# EAGLE schematic Lab5 (EAGLE 7.0.0)
Lab 5 Jonathan Valvano
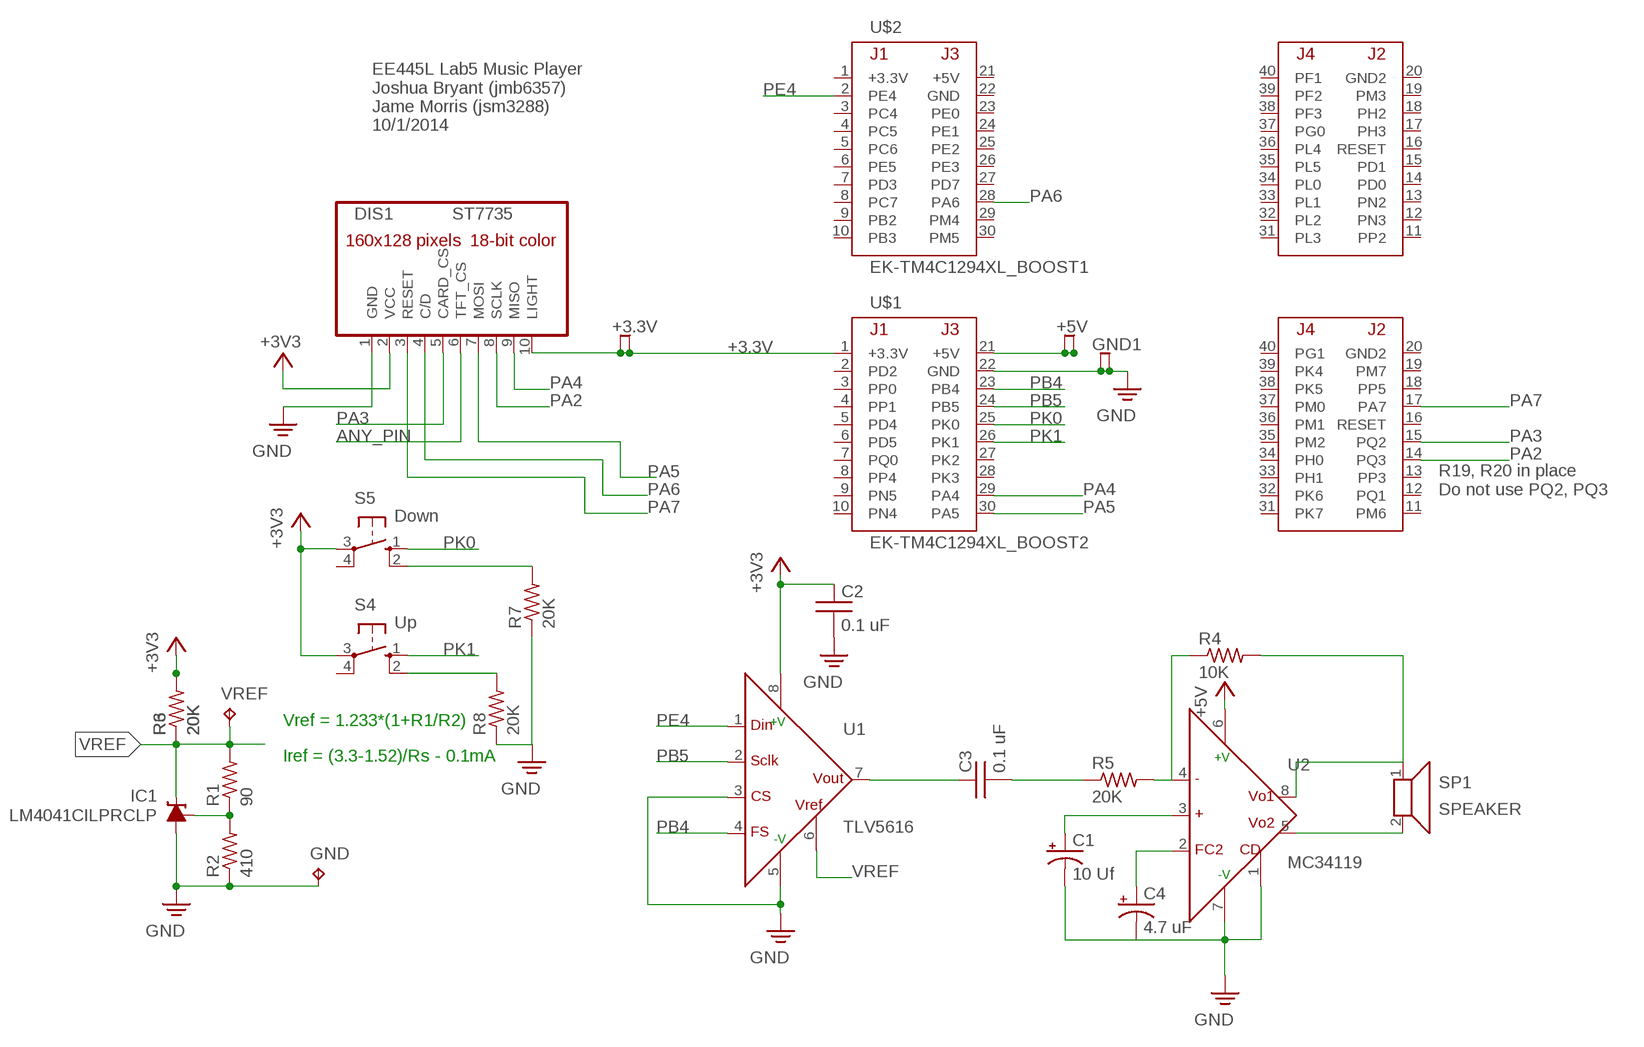
[diagram p0: schematic, sheet 1]

## Parts
+3.3V  TP2  [TP2]
+5V  TP2  [TP2]
C1  10 Uf  CAPACITOR_POLARIZEDE5-6  [CAP200MILPOLARIZED]
C2  0.1 uF  CAPACITOR050-024X044  [CAP200MIL]
C3  0.1 uF  CAPACITOR050-024X044  [CAP200MIL]
C4  4.7 uF  CAPACITOR_POLARIZEDE5-6  [CAP200MILPOLARIZED]
DIS1  ST7735  [ST7735]
GND  TP_KEYSTONE500X  [P1.1MM]
GND1  TP2  [TP2]
IC1  LM4041CILPRCLP  [LP_O-PBCY-W3]
R1  90  RESISTOR0204/7  [RES300MIL]
R2  410  RESISTOR0204/7  [RES300MIL]
R3  20K  RESISTOR0204/7  [RES300MIL]
R4  10K  RESISTOR0204/7  [RES300MIL]
R5  20K  RESISTOR0204/7  [RES300MIL]
R6  20K  RESISTOR0204/7  [RES300MIL]
R7  20K  RESISTOR0204/7  [RES300MIL]
R8  20K  RESISTOR0204/7  [RES300MIL]
S4  Up  B3F-1052  [B3F-10XX]
S5  Down  B3F-1052  [B3F-10XX]
SP1  SPEAKER  [1X02]
U1  TLV5616  [DIL08]
U2  MC34119  [DIL08]
U$1  EK-TM4C1294XL_BOOST2  [TM4C123LAUNCHPAD]
U$2  EK-TM4C1294XL_BOOST1  [TM4C123LAUNCHPAD]
VREF  TP_KEYSTONE500X  [P1.1MM]

## Nets
+3.3V: +3.3V.MP1(TPB) +3.3V.MP(TPA) DIS1.2(VCC) DIS1.10(LIGHT) U$1.1(+3.3V) ; supply symbol labelled +3V3
+3V3: C2.1 R3.2 R6.2 S4.3(P) S5.3(P) U1.8(VDD)
+5V: U2.6(VCC)
+5V1: +5V.MP1(TPB) +5V.MP(TPA) U$1.21(+5V)
ANY_PIN: DIS1.6(TFT_CS)
FB: IC1.1(FB) R1.1 R2.2
GND: C1.- C2.2 C4.- DIS1.1(GND) GND1.MP1(TPB) GND1.MP(TPA) GND.TP IC1.3(A) R2.1 R7.1 R8.1 U1.5(AGND) U2.1(CD) U2.7(GND) U$1.22(GND)
N$1: SP1.2
N$2: R4.2 SP1.1 U2.8(VO1)
N$3: C3.2 R5.1
N$4: U1.3(CS)
N$5: C3.1 U1.7(OUT)
N$6: R4.1 R5.2 U2.4(VIN)
N$7: C1.+ U2.3(FC1)
N$8: C4.+ U2.2(FC2)
N$9: R7.2 S5.2(S1)
N$10: R8.2 S4.2(S1)
PA2: DIS1.8(SCLK) U$1.14(PQ3)
PA3: DIS1.5(CARD_CS) U$1.15(PQ2)
PA4: DIS1.9(MISO) U$1.29(PA4)
PA5: DIS1.7(MOSI) U$1.30(PA5)
PA6: DIS1.4(C/D) U$2.28(PA6)
PA7: DIS1.3(RESET) U$1.17(PA7)
PB4: U1.4(FS) U$1.23(PB4)
PB5: U1.2(SCLK) U$1.24(PB5)
PE4: U1.1(DIN)
PK0: S5.1(S) U$1.25(PK0)
PK1: S4.1(S) U$1.26(PK1)
VREF: IC1.2(C) R1.2 R3.1 R6.1 U1.6(REFIN) VREF.TP
Unconnected: S4.4(P1) S5.4(P1) U2.5(VO2) U$1.2(PD2) U$1.3(PP0) U$1.4(PP1) U$1.5(PD4) U$1.6(PD5) U$1.7(PQ0) U$1.8(PP4) U$1.9(PN5) U$1.10(PN4) U$1.11(PM6) U$1.12(PQ1) U$1.13(PP3) U$1.16(RESET) U$1.18(PP5) U$1.19(PM7) U$1.27(PK2) U$1.28(PK3) U$1.31(PK7) U$1.32(PK6) U$1.33(PH1) U$1.34(PH0) U$1.35(PM2) U$1.36(PM1) U$1.37(PM0) U$1.38(PK5) U$1.39(PK4) U$1.40(PG1) U$2.2(PE4) U$2.3(PC4) U$2.4(PC5) U$2.5(PC6) U$2.6(PE5) U$2.7(PD3) U$2.8(PC7) U$2.9(PB2) U$2.10(PB3) U$2.11(PP2) U$2.12(PN3) U$2.13(PN2) U$2.14(PD0) U$2.15(PD1) U$2.16(RESET) U$2.17(PH3) U$2.18(PH2) U$2.19(PM3) U$2.23(PE0) U$2.24(PE1) U$2.25(PE2) U$2.26(PE3) U$2.27(PD7) U$2.29(PM4) U$2.30(PM5) U$2.31(PL3) U$2.32(PL2) U$2.33(PL1) U$2.34(PL0) U$2.35(PL5) U$2.36(PL4) U$2.37(PG0) U$2.38(PF3) U$2.39(PF2) U$2.40(PF1)

## Notes on the sheet
- EE445L Lab5 Music Player
  Joshua Bryant (jmb6357)
  Jame Morris (jsm3288)
  10/1/2014
- R19, R20 in place
  Do not use PQ2, PQ3
- Vref = 1.233*(1+R1/R2)
- Iref = (3.3-1.52)/Rs - 0.1mA

## Power pins joined to a net without a drawn wire
+3.3V: U$2.1(+3.3V)
+5V: U$2.21(+5V)
GND: U$2.22(GND)
GND2: U$1.20(GND2) U$2.20(GND2)

## Library data of the parts
+3.3V +5V GND1 = EE445L:TP2: Low-cost test point Made with two 0.8mm holes.
C1 C4 = EE445L:CAPACITOR_POLARIZED: POLARIZED CAPACITOR, American symbol
C2 C3 = EE445L:CAPACITOR: CAPACITOR, American symbol
DIS1 = EE445L:ST7735: Sitronix ST7735R 18-bit color, 1.8" TFT LCD display, 128*160, http://www.adafruit.com/products/358 // Backlight (pin 10) connected to +3.3 V // MISO (pin 9) PA4 (SSI0Rx) // SCK (pin 8) connected to PA2 (SSI0Clk) // MOSI (pin 7) connected to PA5 (SSI0Tx) // TFT_CS (pin 6) connected to PA3 (SSI0Fss) // CARD_CS (pin 5) connected to PD7 GPIO output(for SDC) // Data/Command (pin 4) connected to PA6 (GPIO), high for data, low for command // RESET (pin 3) connected to PA7 (GPIO) // VCC (pin 2) connected to +3.3 V // Gnd (pin 1) connected to ground; OC_FARNELL: unknown; OC_NEWARK: unknown
GND VREF = EE445L:TP: Test pad Test point, black, Keystone Electronics 5001, Digikey 5001K-ND Test point, orange, Keystone Electronics 5003, Digikey 5003K-ND Test point, yellow, Keystone Electronics 5004, Digikey 5004K-ND Test point, white, Keystone Electronics 5002, Digikey 5002K-ND Test point, red, Keystone Electronics 5000, Digikey 5000K-ND
IC1 = EE445L:LM4041CILPR: PRECISION MICROPOWER SHUNT VOLTAGE REFERENCE Adjustable Output Source: http://focus.ti.com/lit/ds/slcs146e/slcs146e.pdf LM4041CILPR Let R1 be the resistor from Vref to +3.3V Let R2 be the resistor from Vref to FB Let R3 be the resistor from FB to ground Vref = 1.23*(1+R3/R2) Iref=(3.3V-Vref)/R1 - 100uA; MPN: LM4041CILP; OC_FARNELL: 1673945; OC_NEWARK: 50M8856
R1-R8 = EE445L:RESISTOR: RESISTOR, American symbol
S4 S5 = EE445L:B3F-1052: OMRON SWITCH 1.1mm holes; MPN: B3F-1000; OC_FARNELL: 176432; OC_NEWARK: 36M3542
SP1 = EE445L:SPEAKER: Speaker Connected off PCB with two wires. 32-ohm speaker, AllElectronics, SK-230, http://www.allelectronics.com/make-a-store/item/sk-230/20-mm-32-ohm-speaker/1.html
U1 = EE445L:TLV5616: TLV5616 12-bit DAC SSI digital input, one analog output Vout = (2*n*Vref)/4096
U2 = EE445L:MC34119: MC34119 Audio amp http://users.ece.utexas.edu/~valvano/Datasheets/MC34119.pdf The MC34119 is a low power audio amplifier intergrated circuit intended (primarily) for telephone applications, such as in speakerphones. It provides differential speaker outputs to maximize output swing at low supply voltages (2.0 V minimum). Coupling capacitors to the speaker are not required. Open loop gain is 80 dB, and the closed loop gain is set with two external resistors. A Chip Disable pin permits powering down and/or muting the input signal. The MC34119 is available in standard 8–pin DIP, SOIC package, and TSSOP package. • Wide Operating Supply Voltage Range (2.0 V to 16 V), Allows Telephone Line Powered Applications • Low Quiescent Supply Current (2.7 mA Typ) for Battery Powered Applications • Chip Disable Input to Power Down the IC • Low Power–Down Quiescent Current (65 mA Typ) • Drives a Wide Range of Speaker Loads (8.0 W and Up) • Output Power Exceeds 250 mW with 32 W Speaker • Low Total Harmonic Distortion (0.5% Typ) • Gain Adjustable from <0 dB to >46 dB for Voice Band • Requires Few External Components
U$1 = EE445L:EK-TM4C1294XL_BOOST2: Booster pack 2, Texas Instruments TM4C1294 Connected LaunchPad www.ti.com/tool/ek-tm4c1294xl This board is based on the TM4C1294NCPDT microcontroller, which is a120MHz 32-bit ARM Cortex-M4 CPU with floating point, 1MB Flash, 256KB SRAM, 6KB EEPROM, Integrated 10/100 Ethernet MAC+PHY, data protection hardware, 8x 32-bit timers, dual 12-bit 2MSPS ADCs, motion control PWMs, USB H/D/O
U$2 = EE445L:EK-TM4C1294XL_BOOST1: Booster pack 1, Texas Instruments TM4C1294 Connected LaunchPad www.ti.com/tool/ek-tm4c1294xl This board is based on the TM4C1294NCPDT microcontroller, which is a120MHz 32-bit ARM Cortex-M4 CPU with floating point, 1MB Flash, 256KB SRAM, 6KB EEPROM, Integrated 10/100 Ethernet MAC+PHY, data protection hardware, 8x 32-bit timers, dual 12-bit 2MSPS ADCs, motion control PWMs, USB H/D/O

## Net classes
0 default: clearance 0.205 mm